# Altium schematic sheet MCU.SchDoc
size A; SheetNumber: 2; SheetTotal: 3
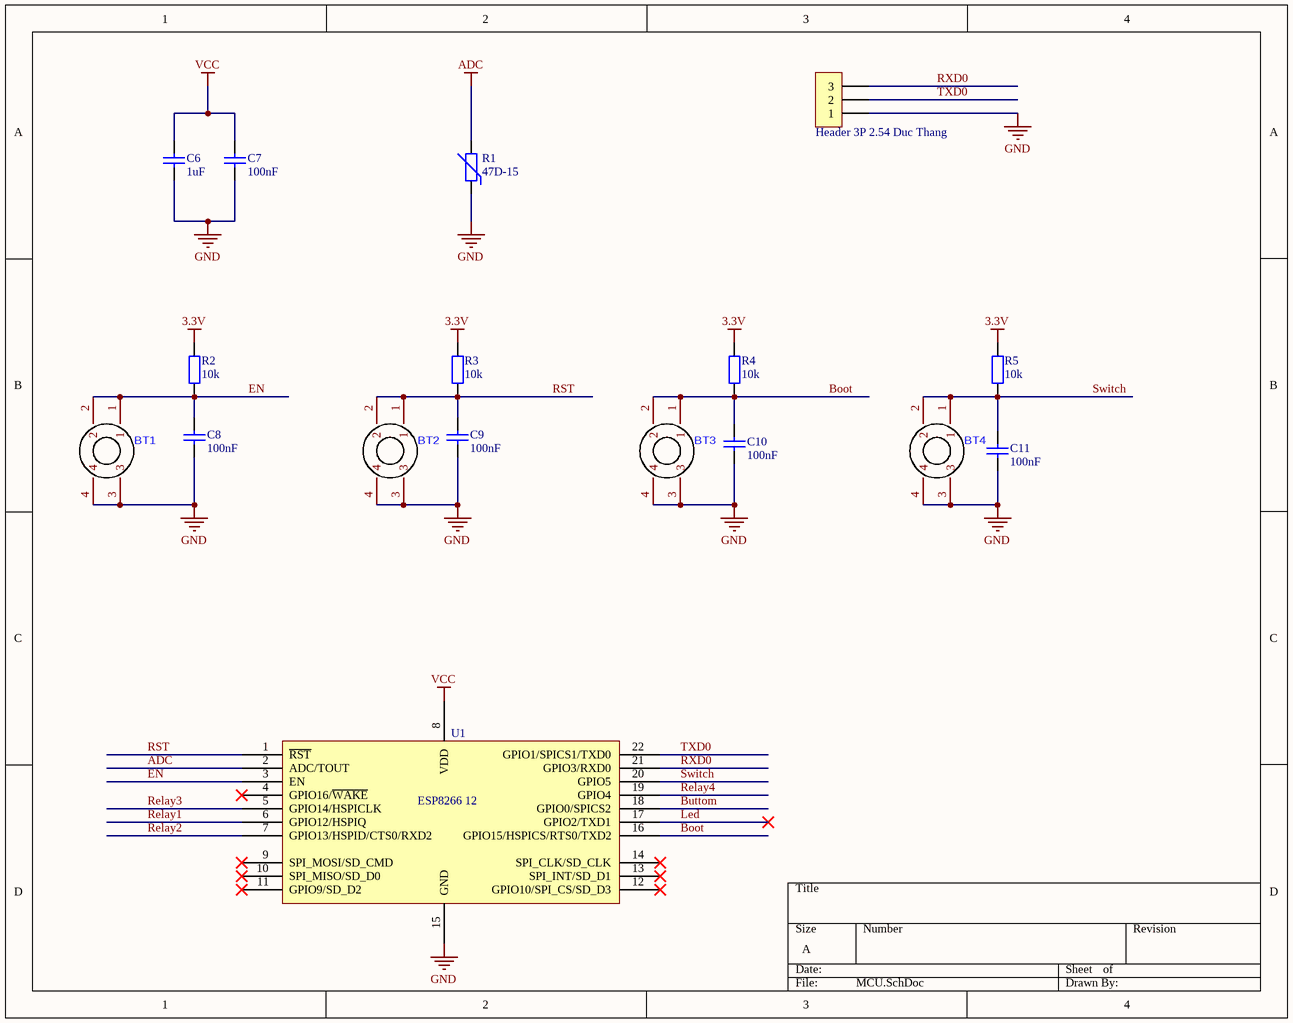
[diagram p0: MCU.SchDoc]

## Parts
BT1  Nut Nhan 4 chan 12x12  [12X12 BUTTOM red]  (value not drawn)
BT2  Nut Nhan 4 chan 12x12  [12X12 BUTTOM red]  (value not drawn)
BT3  Nut Nhan 4 chan 12x12  [12X12 BUTTOM red]  (value not drawn)
BT4  Nut Nhan 4 chan 12x12  [12X12 BUTTOM red]  (value not drawn)
C6  1uF  [tu gom]
C7  100nF  [tu gom]
C8  100nF  [tu gom]
C9  100nF  [tu gom]
C10  100nF  [tu gom]
C11  100nF  [tu gom]
H1  Header 3P 2.54 Duc Thang  [XH2.54M-3]
R1  47D-15  [tro nhiet d15]
R2  10k  [tro vach 1/2w]
R3  10k  [tro vach 1/2w]
R4  10k  [tro vach 1/2w]
R5  10k  [tro vach 1/2w]
U1  ESP8266 12  [ESP8266 12]

## Nets
3.3V: R2.2 R3.2 R4.2 R5.2
ADC: R1.2 U1.2(ADC/TOUT)
GND: BT1.3 BT1.4 BT2.3 BT2.4 BT3.3 BT3.4 BT4.3 BT4.4 C6.2 C7.2 C8.2 C9.2 C10.2 C11.2 H1.1 R1.1 U1.15(GND)
VCC: C6.1 C7.1 U1.8(VDD)
Boot: BT3.1 BT3.2 C10.1 R4.1 U1.16(GPIO15/HSPICS/RTS0/TXD2)
Buttom: U1.18(GPIO0/SPICS2)
EN: BT1.1 BT1.2 C8.1 R2.1 U1.3(EN)
Led: U1.17(GPIO2/TXD1)
Relay1: U1.6(GPIO12/HSPIQ)
Relay2: U1.7(GPIO13/HSPID/CTS0/RXD2)
Relay3: U1.5(GPIO14/HSPICLK)
Relay4: U1.19(GPIO4)
RST: BT2.1 BT2.2 C9.1 R3.1 U1.1(~{RST})
RXD0: H1.3 U1.21(GPIO3/RXD0)
Switch: BT4.1 BT4.2 C11.1 R5.1 U1.20(GPIO5)
TXD0: H1.2 U1.22(GPIO1/SPICS1/TXD0)

Not connected (* = marked no-connect by the designer): U1 4(GPIO16/~{WAKE})* 9(SPI_MOSI/SD_CMD)* 10(SPI_MISO/SD_D0)* 11(GPIO9/SD_D2)* 12(GPIO10/SPI_CS/SD_D3)* 13(SPI_INT/SD_D1)* 14(SPI_CLK/SD_CLK)*

## Library data of the parts
C6-C11 = Tu gom 15pF 50V: Cắm; Don_Vi: Con; So_Chan: 2; Ten_Linh_Kien: Tụ gốm 15P 50V; Ma_Hang: MH004767; Chung_Loai: Cắm; Kieu_Chan: *
H1 = Header 3P 2.54 Duc Thang: Cắm; Ten_Linh_Kien: Header 3P XH2.54-3P Đực Thẳng; Don_Vi: Con; Ma_Hang: MH001292; Chung_Loai: Cắm
R1 = Tro Nhiet NTC 47D-15: Cắm; Don_Vi: Con; So_Chan: 2; Ten_Linh_Kien: Điện Trở Nhiệt NTC 47D-15; Ma_Hang: MH005858; Chung_Loai: Cắm; Kieu_Chan: *
R2-R5 = Tro Vach 1/2W 5% 47K: Cắm; Don_Vi: Con; So_Chan: 2; Ten_Linh_Kien: Trở 5% 1/2w 47k; Ma_Hang: MH008002; Chung_Loai: Cắm; Kieu_Chan: *
U1 = ESP8266 12: ESP8266 12 22 Pin; IC: ESP8266-EX; Vendor: Ai-thinker